# EasyEDA schematic SCH_Aperoliker_PCB_2024-01-20.json
TITLE: APEROLiker / HUGOliker; REV: 1.0; Date: 2023-10-25; Sheet: 1/1; Drawn By: F.Stäblein; Company: Copyright 2023 F.Stäblein
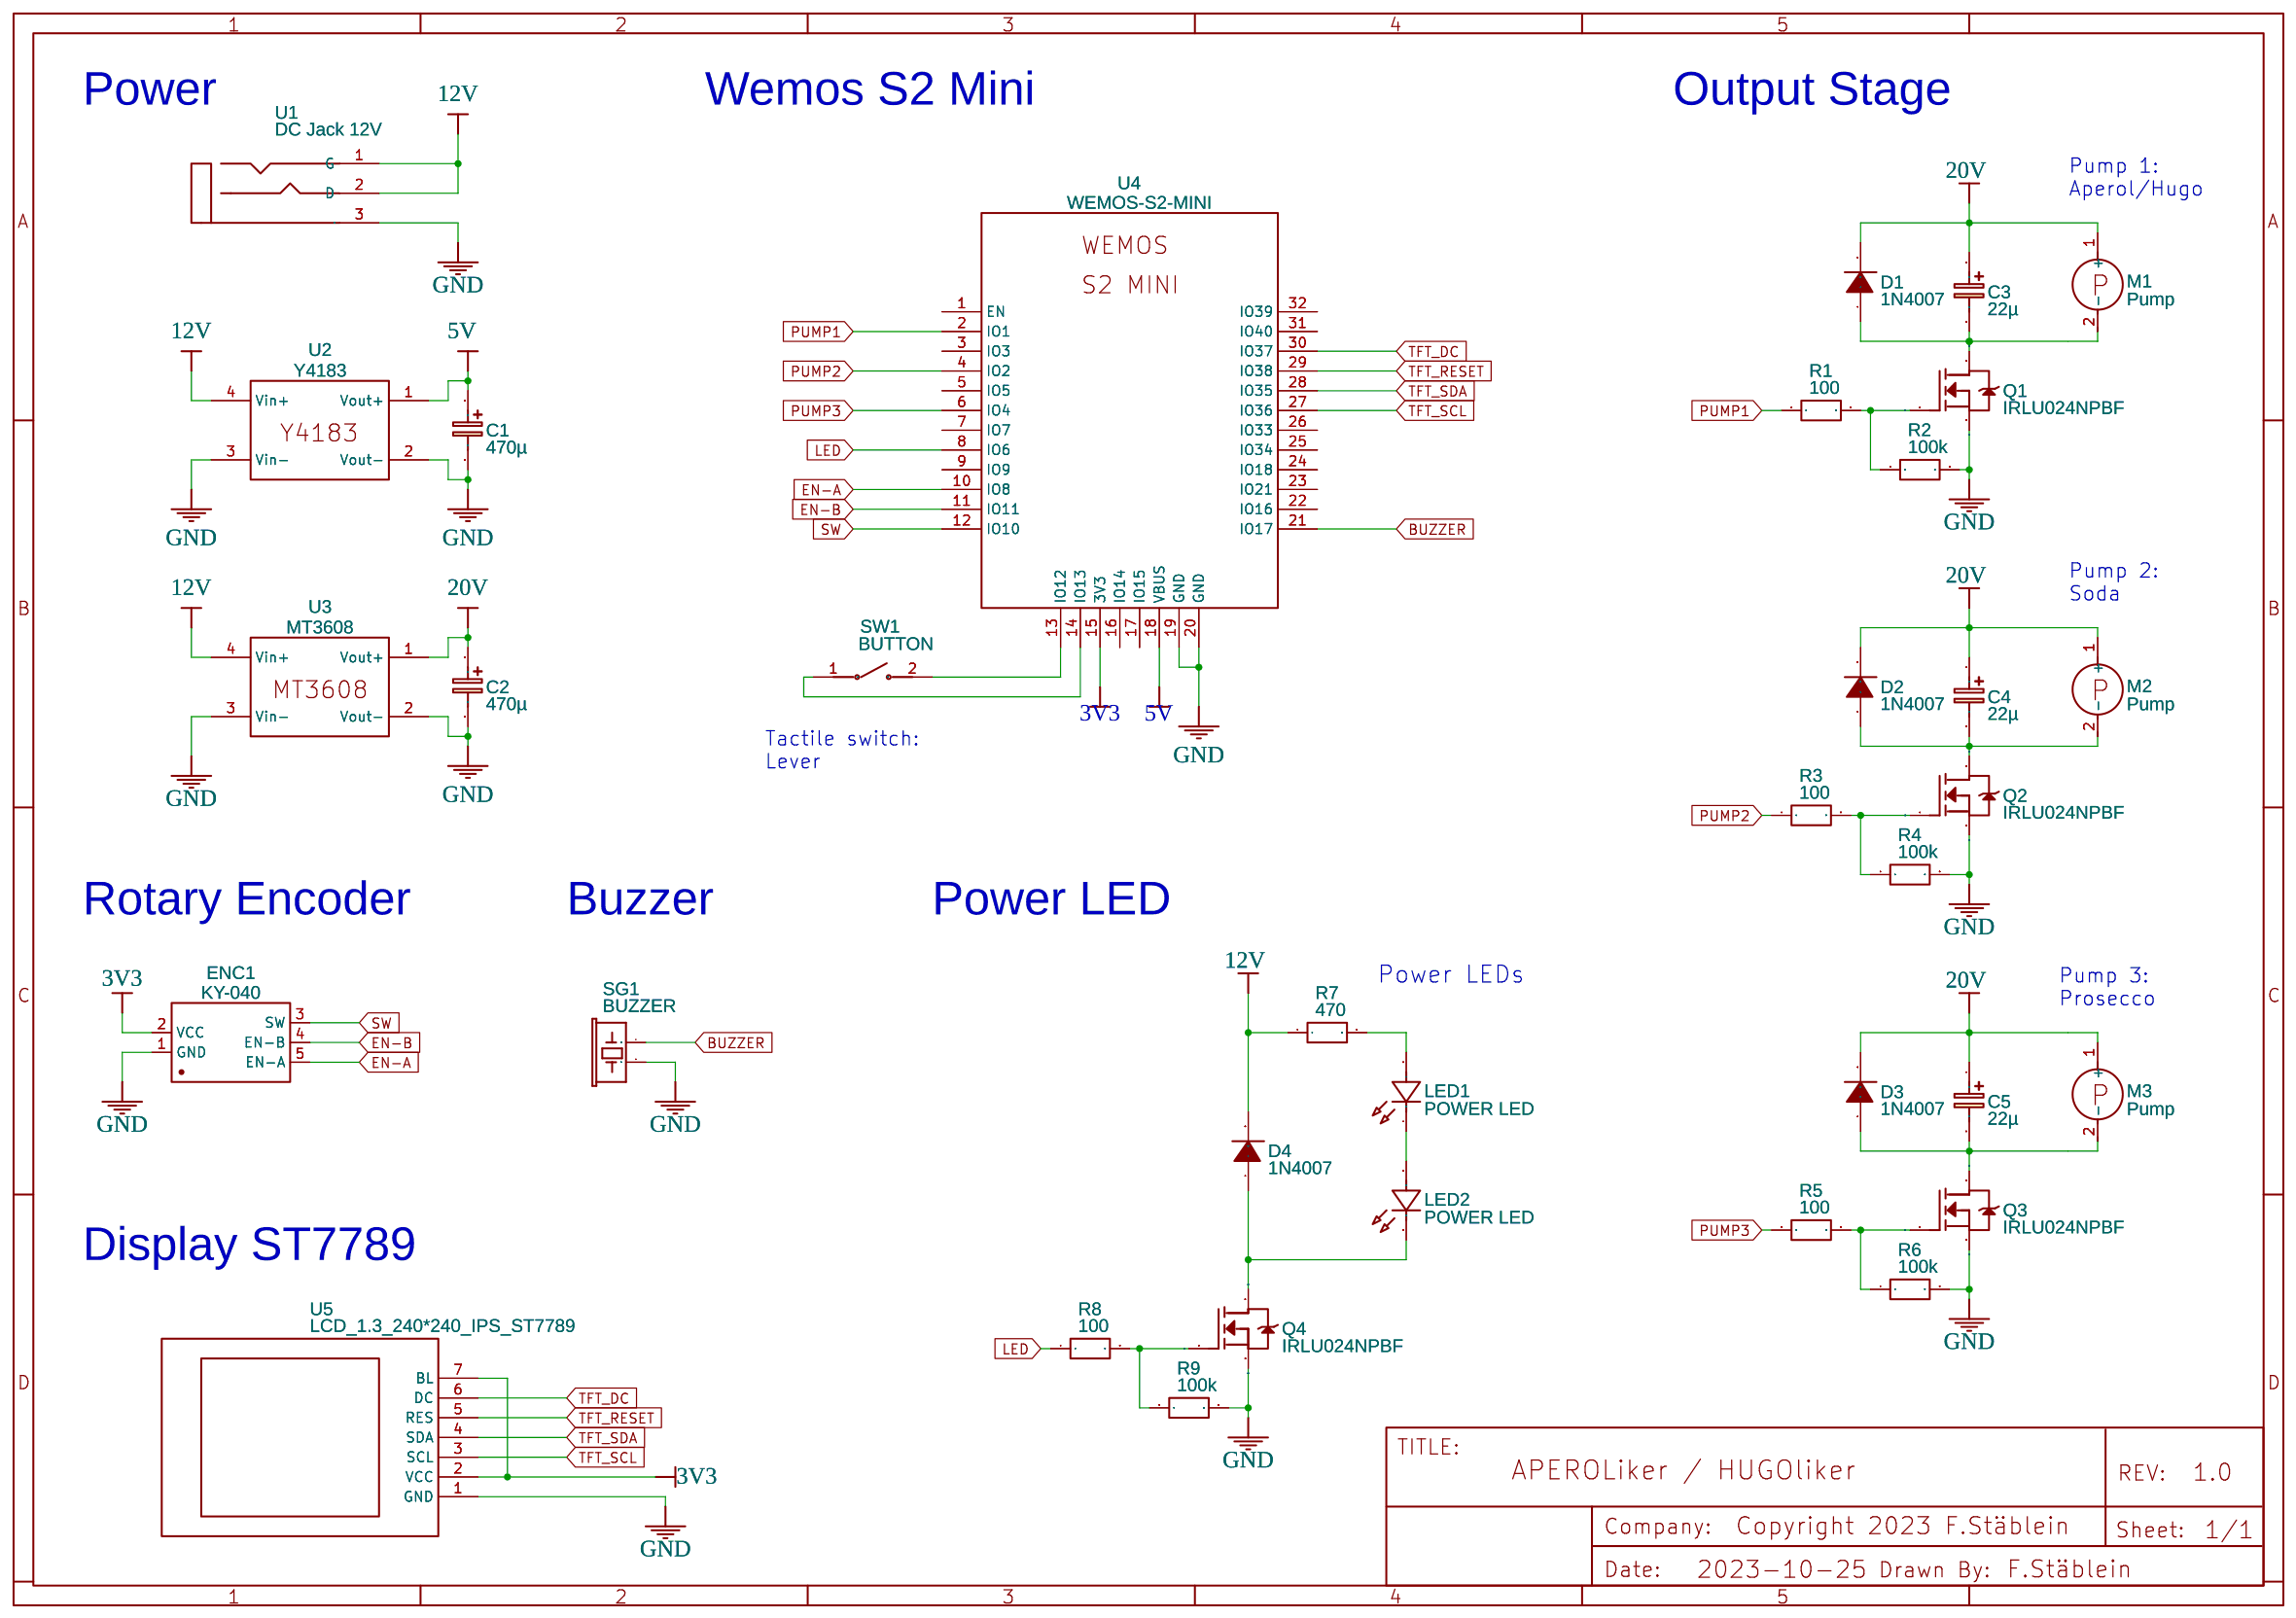
[diagram p0: schematic sheet]

## Parts
C1  470µ  [CASE-A_3216]
C2  470µ  [CASE-A_3216]
C3  22µ  [CASE-A_3216]
C4  22µ  [CASE-A_3216]
C5  22µ  [CASE-A_3216]
D1  1N4007  [DO-35_BD2.0-L4.0-P8.00-D0.5-FD]
D2  1N4007  [DO-35_BD2.0-L4.0-P8.00-D0.5-FD]
D3  1N4007  [DO-35_BD2.0-L4.0-P8.00-D0.5-FD]
D4  1N4007  [DO-35_BD2.0-L4.0-P8.00-D0.5-FD]
ENC1  KY-040  [KY-040]
LED1  POWER LED  [LED-POWER]
LED2  POWER LED  [LED-POWER]
M1  Pump  [CONN-TH_2P-P5.08]
M2  Pump  [CONN-TH_2P-P5.08]
M3  Pump  [CONN-TH_2P-P5.08]
Q1  IRLU024NPBF  [TO-251-3_L6.6-W2.3-PITCH2.28-L]
Q2  IRLU024NPBF  [TO-251-3_L6.6-W2.3-PITCH2.28-L]
Q3  IRLU024NPBF  [TO-251-3_L6.6-W2.3-PITCH2.28-L]
Q4  IRLU024NPBF  [TO-251-3_L6.6-W2.3-PITCH2.28-L]
R1  100  [R0603]
R2  100k  [R0603]
R3  100  [R0603]
R4  100k  [R0603]
R5  100  [R0603]
R6  100k  [R0603]
R7  470  [R0603]
R8  100  [R0603]
R9  100k  [R0603]
SG1  BUZZER  [BUZZER-12MM]
SW1  BUTTON  [SW-SMD_L3.9-W2.9-LS4.9-L]
U1  DC Jack 12V  [JACK-2.5MM_B]
U2  Y4183  [MT3608_1]
U3  MT3608  [MT3608_1]
U4  WEMOS-S2-MINI  [WEMOS-S2-MINI]
U5  LCD_1.3_240*240_IPS_ST7789  [LCD_1.3_240*240_IPS_ST7789]

## Library data of the parts
C1-C5 = C_Tan_SMD_A_EU: Contributor: LCEDA_Lib
D1-D4 = 1N4148: Supplier: LCSC; Manufacturer: ST(先科); Supplier Part: C14516; JLCPCB Part Class: Extended Part; link: https://lcsc.com/eda_search?q=C14516&%26type=1&ref=editor
ENC1 = KY-040: Manufacturer: N/A; Manufacturer Part: N/A; Supplier Part: N/A; Contributor: pjgerow
LED1 LED2 = XL-302SURD: JLCPCB Part Class: Extended Part; Contributor: kradify
M1-M3 = Pump: Contributor: tonto069301; license: https://www.gnu.org/licenses/lgpl-2.1.html
Q1-Q4 = IRLU024NPBF: Supplier: LCSC; Manufacturer: Infineon(英飞凌); Supplier Part: C3024; JLCPCB Part Class: Extended Part; link: https://lcsc.com/eda_search?q=C3024&%26type=1&ref=editor
R1-R9 = R_0603_EU: Contributor: LCEDA_Lib
SG1 = BUZZER: Contributor: SparkFun
SW1 = BUTTON: Contributor: lcsc; Supplier: LCSC; Supplier Part: C9900015607; Manufacturer: null; JLCPCB Part Class: Extended Part; link: https://lcsc.com/eda_search?q=C9900015607&%26type=1&ref=editor
U1 = Jack CCC: Contributor: elmago
U2 U3 = MT3608_3: Contributor: Vladimirgoodvin
U4 = WEMOS-S2-MINI: Manufacturer: WEMOS; Manufacturer Part: Wemos; Supplier Part: WEMOS_S2_MINI; link: https://www.wemos.cc/en/latest/s2/s2_mini.html?spm=a2g0o.detail.1000023.1.36da1596ZoDwKF; Contributor: crevetator2000
U5 = LCD_1.3_240*240_IPS_ST7789: Contributor: puzrin

## Nets
3V3: ENC1.2(VCC) U4.15(3V3) U5.2(VCC) U5.7(BL)
5V: C1.1 U2.1(Vout+) U4.18(VBUS)
12V: D4.2(C) R7.1 U1.1(G) U1.2(D) U2.4(Vin+) U3.4(Vin+)
20V: C2.1 C3.1 C4.1 C5.1 D1.2(C) D2.2(C) D3.2(C) M1.1(+) M2.1(+) M3.1(+) U3.1(Vout+)
GND: C1.2 C2.2 ENC1.1(GND) Q1.3(S) Q2.3(S) Q3.3(S) Q4.3(S) R2.2 R4.2 R6.2 R9.2 SG1.+(1) U1.3 U2.2(Vout-) U2.3(Vin-) U3.2(Vout-) U3.3(Vin-) U4.19(GND) U4.20(GND) U5.1(GND)
BUZZER: SG1.-(2) U4.21(IO17)
EN-A: ENC1.5(EN-A) U4.10(IO8)
EN-B: ENC1.4(EN-B) U4.11(IO11)
LED: R8.1 U4.8(IO6)
PUMP1: R1.1 U4.2(IO1)
PUMP2: R3.1 U4.4(IO2)
PUMP3: R5.1 U4.6(IO4)
SW: ENC1.3(SW) U4.12(IO10)
TFT_DC: U4.30(IO37) U5.6(DC)
TFT_RESET: U4.29(IO38) U5.5(RES)
TFT_SCL: U4.27(IO36) U5.3(SCL)
TFT_SDA: U4.28(IO35) U5.4(SDA)
Net-(C3-2): C3.2 D1.1(A) M1.2(-) Q1.2(D)
Net-(C4-2): C4.2 D2.1(A) M2.2(-) Q2.2(D)
Net-(C5-2): C5.2 D3.1(A) M3.2(-) Q3.2(D)
Net-(D4-1): D4.1(A) LED2.1(K) Q4.2(D)
Net-(LED1-1): LED1.1(K) LED2.2(A)
Net-(LED1-2): LED1.2(A) R7.2
Net-(Q1-1): Q1.1(G) R1.2 R2.1
Net-(Q2-1): Q2.1(G) R3.2 R4.1
Net-(Q3-1): Q3.1(G) R5.2 R6.1
Net-(Q4-1): Q4.1(G) R8.2 R9.1
Net-(SW1-1): SW1.1 U4.14(IO13)
Net-(SW1-2): SW1.2 U4.13(IO12)

Not connected (* = marked no-connect by the designer): U4 1(EN) 3(IO3) 5(IO5) 7(IO7) 9(IO9) 16(IO14) 17(IO15) 22(IO16) 23(IO21) 24(IO18) 25(IO34) 26(IO33) 31(IO40) 32(IO39)

## Notes on the sheet
- Power
- Wemos S2 Mini
- Output Stage
- Pump 1:
  Aperol/Hugo
- Pump 2:
  Soda
- Tactile switch:
  Lever
- Rotary Encoder
- Buzzer
- Power LED
- Power LEDs
- Pump 3:
  Prosecco
- Display ST7789
